# Altium project Fall22 Universal PCB Rev.1.PrjPcb (part 2 of 2)

## Sheet IO.SchDoc
size A2; SPICEModelCacheUFEYCXMP: <root> / <DocumentId>UFEYCXMP</DocumentId> / </root>
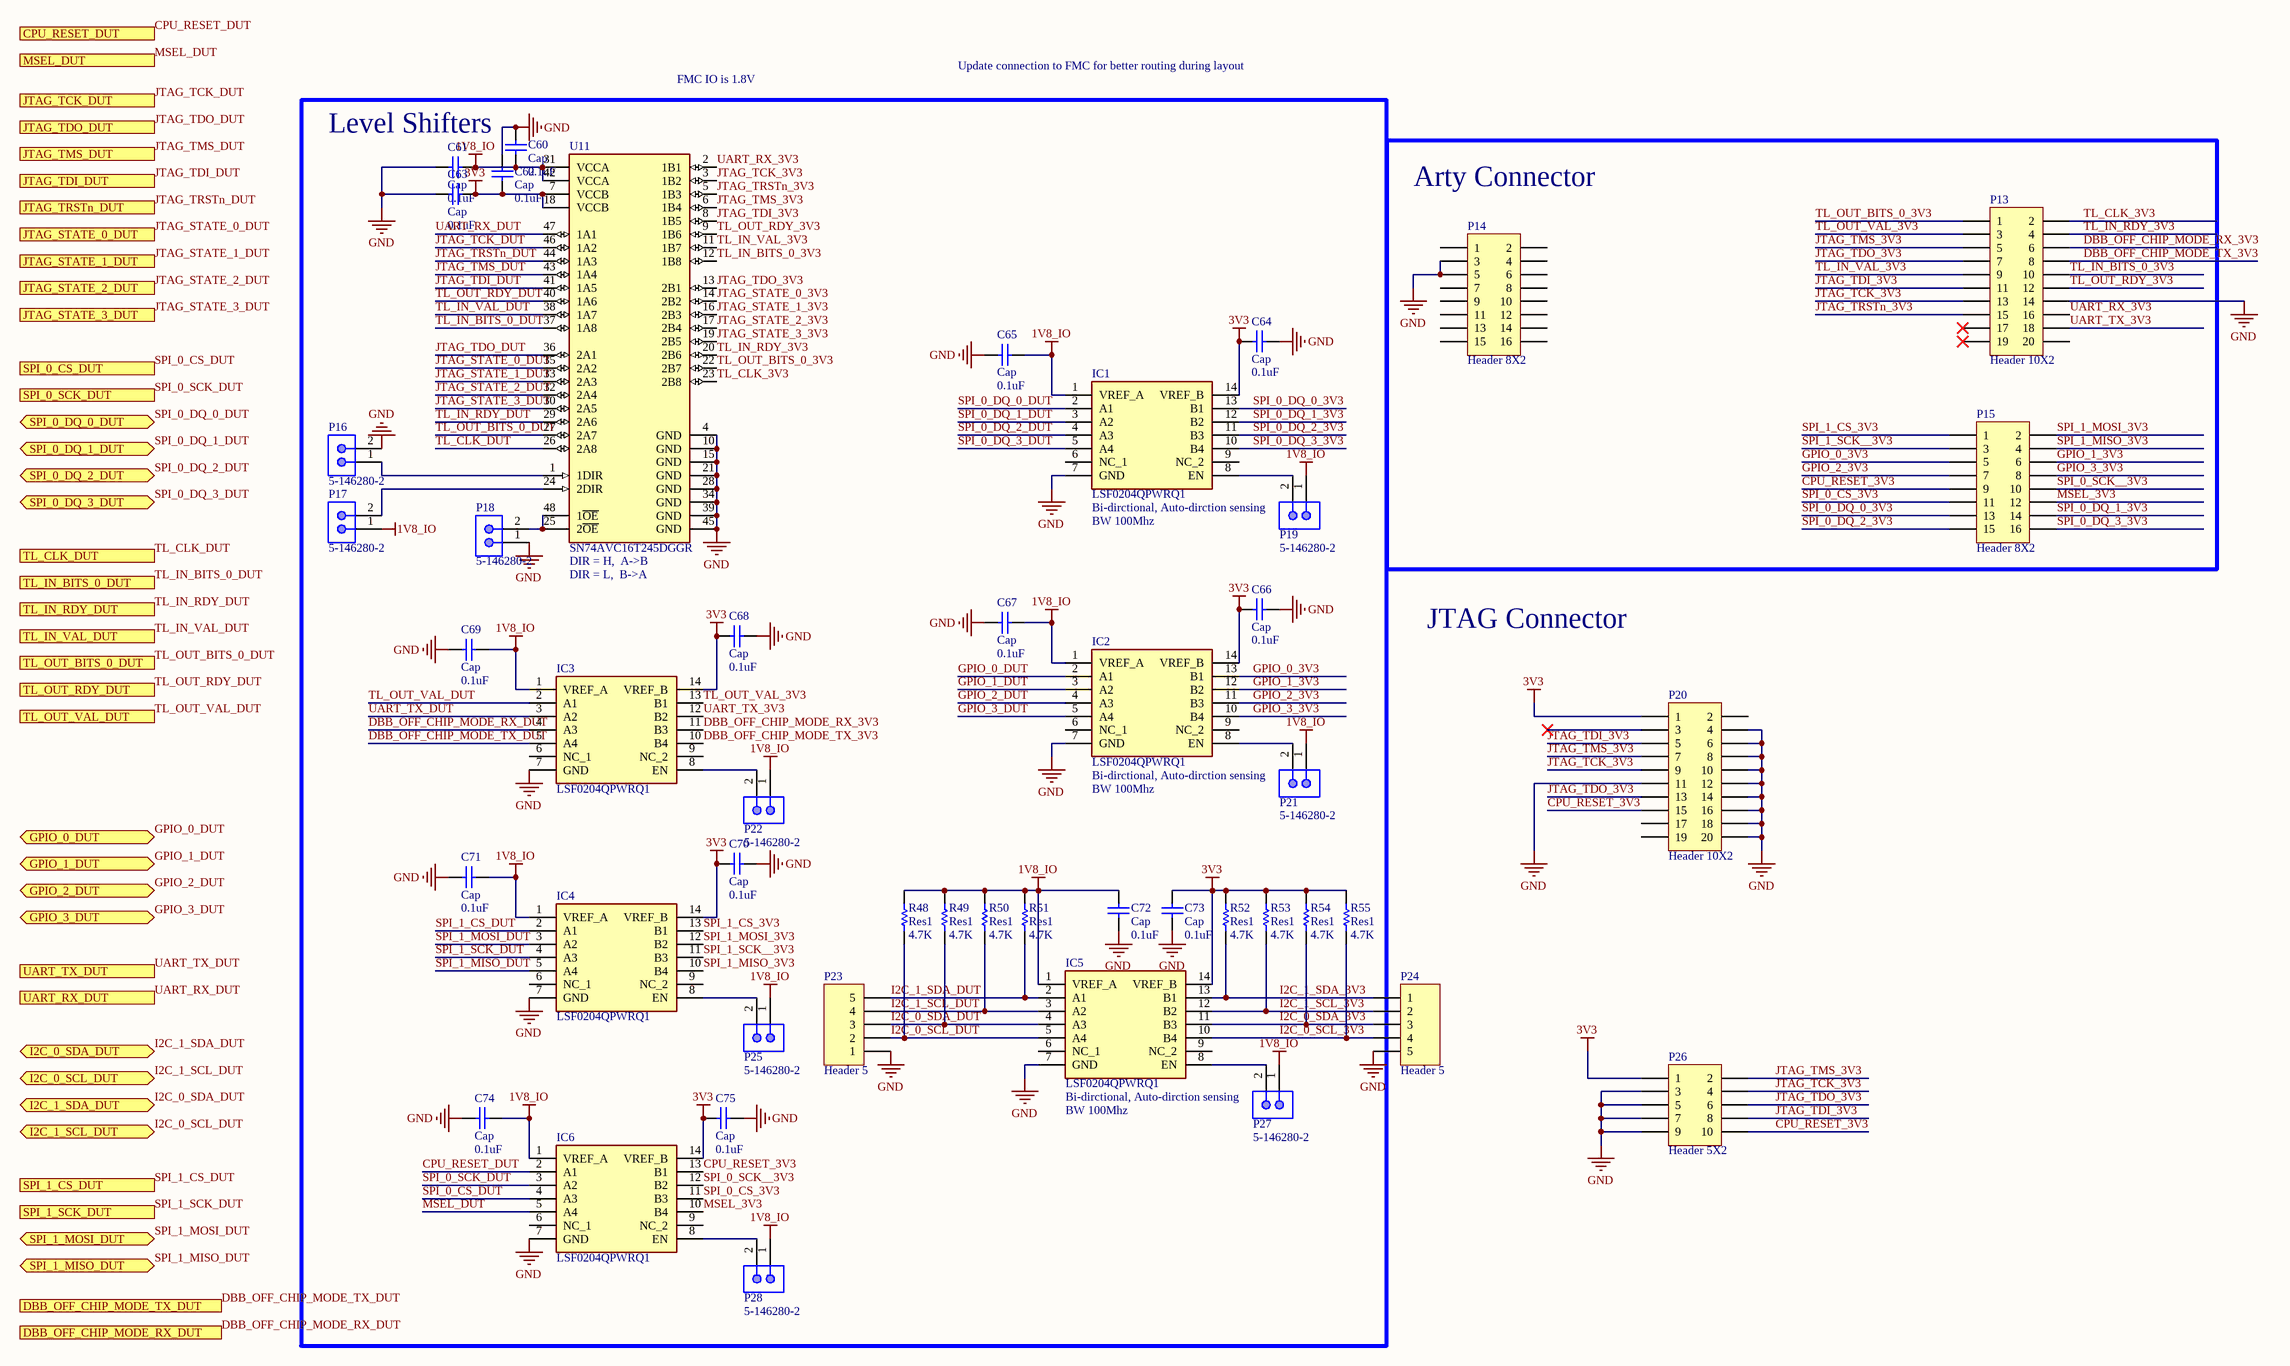
[diagram p7: IO.SchDoc]

### Parts
C60  Cap  value 0.1uF  [0603]
C61  Cap  value 0.1uF  [0603]
C62  Cap  value 0.1uF  [0603]
C63  Cap  value 0.1uF  [0603]
C64  Cap  value 0.1uF  [0603]
C65  Cap  value 0.1uF  [0603]
C66  Cap  value 0.1uF  [0603]
C67  Cap  value 0.1uF  [0603]
C68  Cap  value 0.1uF  [0603]
C69  Cap  value 0.1uF  [0603]
C70  Cap  value 0.1uF  [0603]
C71  Cap  value 0.1uF  [0603]
C72  Cap  value 0.1uF  [0603]
C73  Cap  value 0.1uF  [0603]
C74  Cap  value 0.1uF  [0603]
C75  Cap  value 0.1uF  [0603]
IC1  LSF0204QPWRQ1  [SOP65P640X120-14N]
IC2  LSF0204QPWRQ1  [SOP65P640X120-14N]
IC3  LSF0204QPWRQ1  [SOP65P640X120-14N]
IC4  LSF0204QPWRQ1  [SOP65P640X120-14N]
IC5  LSF0204QPWRQ1  [SOP65P640X120-14N]
IC6  LSF0204QPWRQ1  [SOP65P640X120-14N]
P13  Header 10X2  [HDR2X10]
P14  Header 8X2  [HDR2X8]
P15  Header 8X2  [HDR2X8]
P16  5-146280-2  [TECO-5-146280-2_V]
P17  5-146280-2  [TECO-5-146280-2_V]
P18  5-146280-2  [TECO-5-146280-2_V]
P19  5-146280-2  [TECO-5-146280-2_V]
P20  Header 10X2  [HDR2X10]
P21  5-146280-2  [TECO-5-146280-2_V]
P22  5-146280-2  [TECO-5-146280-2_V]
P23  Header 5  [HDR1X5]
P24  Header 5  [HDR1X5]
P25  5-146280-2  [TECO-5-146280-2_V]
P26  Header 5X2  [HDR2X5]
P27  5-146280-2  [TECO-5-146280-2_V]
P28  5-146280-2  [TECO-5-146280-2_V]
R48  Res1  value 4.7K  [0603]
R49  Res1  value 4.7K  [0603]
R50  Res1  value 4.7K  [0603]
R51  Res1  value 4.7K  [0603]
R52  Res1  value 4.7K  [0603]
R53  Res1  value 4.7K  [0603]
R54  Res1  value 4.7K  [0603]
R55  Res1  value 4.7K  [0603]
U11  SN74AVC16T245DGGR  [FP-DGG0048A-IPC_B]

### Blocks framed on the sheet
Level Shifters: C60-C75 IC1-IC6 P16-P19 P21-P23 P25 P27 P28 R48-R55 U11
Arty Connector: P13-P15

### Ports
CPU_RESET_DUT (out), DBB_OFF_CHIP_MODE_RX_DUT (in), DBB_OFF_CHIP_MODE_TX_DUT (in), GPIO_0_DUT (bidir), GPIO_1_DUT (bidir), GPIO_2_DUT (bidir), GPIO_3_DUT (bidir), I2C_0_SCL_DUT (bidir), I2C_0_SDA_DUT (bidir), I2C_1_SCL_DUT (bidir), I2C_1_SDA_DUT (bidir), JTAG_STATE_0_DUT (in), JTAG_STATE_1_DUT (in), JTAG_STATE_2_DUT (in), JTAG_STATE_3_DUT (in), JTAG_TCK_DUT (out), JTAG_TDI_DUT (out), JTAG_TDO_DUT (in), JTAG_TMS_DUT (out), JTAG_TRSTn_DUT (out), MSEL_DUT (out), SPI_0_CS_DUT (in), SPI_0_DQ_0_DUT (bidir), SPI_0_DQ_1_DUT (bidir), SPI_0_DQ_2_DUT (bidir), SPI_0_DQ_3_DUT (bidir), SPI_0_SCK_DUT (in), SPI_1_CS_DUT (in), SPI_1_MISO_DUT (bidir), SPI_1_MOSI_DUT (bidir), SPI_1_SCK_DUT (in), TL_CLK_DUT (in), TL_IN_BITS_0_DUT (out), TL_IN_RDY_DUT (in), TL_IN_VAL_DUT (out), TL_OUT_BITS_0_DUT (in), TL_OUT_RDY_DUT (out), TL_OUT_VAL_DUT (in), UART_RX_DUT (out), UART_TX_DUT (in)

### Nets
1V8_IO: C60.2 C61.1 C65.1 C67.1 C69.1 C71.1 C72.2 C74.1 IC1.1(VREF_A) IC2.1(VREF_A) IC3.1(VREF_A) IC4.1(VREF_A) IC5.1(VREF_A) IC6.1(VREF_A) P17.1 P19.1 P21.1 P22.1 P25.1 P27.1 P28.1 R48.2 R49.2 R50.2 R51.2 U11.31(VCCA) U11.42(VCCA)
3V3: C62.2 C63.1 C64.2 C66.2 C68.2 C70.2 C73.2 C75.2 IC1.14(VREF_B) IC2.14(VREF_B) IC3.14(VREF_B) IC4.14(VREF_B) IC5.14(VREF_B) IC6.14(VREF_B) P20.1 P26.1 R52.2 R53.2 R54.2 R55.2 U11.7(VCCB) U11.18(VCCB)
GND: C60.1 C61.2 C62.1 C63.2 C64.1 C65.2 C66.1 C67.2 C68.1 C69.2 C70.1 C71.2 C72.1 C73.1 C74.2 C75.1 IC1.7(GND) IC2.7(GND) IC3.7(GND) IC4.7(GND) IC5.7(GND) IC6.7(GND) P13.14 P14.3 P14.5 P16.2 P18.1 P20.4 P20.6 P20.8 P20.10 P20.11 P20.12 P20.14 P20.16 P20.18 P20.20 P23.1 P24.5 P26.3 P26.5 P26.7 P26.9 U11.4(GND) U11.10(GND) U11.15(GND) U11.21(GND) U11.28(GND) U11.34(GND) U11.39(GND) U11.45(GND)
CPU_RESET_3V3: IC6.13(B1) P15.9 P20.15 P26.10
CPU_RESET_DUT: IC6.2(A1) ; port CPU_RESET_DUT
DBB_OFF_CHIP_MODE_RX_3V3: IC3.11(B3) P13.6
DBB_OFF_CHIP_MODE_RX_DUT: IC3.4(A3) ; port DBB_OFF_CHIP_MODE_RX_DUT  [project net baseband_offChipMode_rx]
DBB_OFF_CHIP_MODE_TX_3V3: IC3.10(B4) P13.8
DBB_OFF_CHIP_MODE_TX_DUT: IC3.5(A4) ; port DBB_OFF_CHIP_MODE_TX_DUT  [project net baseband_offChipMode_tx]
GPIO_0_3V3: IC2.13(B1) P15.5
GPIO_0_DUT: IC2.2(A1) ; port GPIO_0_DUT
GPIO_1_3V3: IC2.12(B2) P15.6
GPIO_1_DUT: IC2.3(A2) ; port GPIO_1_DUT
GPIO_2_3V3: IC2.11(B3) P15.7
GPIO_2_DUT: IC2.4(A3) ; port GPIO_2_DUT
GPIO_3_3V3: IC2.10(B4) P15.8
GPIO_3_DUT: IC2.5(A4) ; port GPIO_3_DUT
I2C_0_SCL_3V3: IC5.10(B4) P24.4 R55.1
I2C_0_SCL_DUT: IC5.5(A4) P23.2 R48.1 ; port I2C_1_SCL_DUT
I2C_0_SDA_3V3: IC5.11(B3) P24.3 R54.1
I2C_0_SDA_DUT: IC5.4(A3) P23.3 R49.1 ; port I2C_1_SDA_DUT
I2C_1_SCL_3V3: IC5.12(B2) P24.2 R53.1
I2C_1_SCL_DUT: IC5.3(A2) P23.4 R50.1 ; port I2C_0_SCL_DUT
I2C_1_SDA_3V3: IC5.13(B1) P24.1 R52.1
I2C_1_SDA_DUT: IC5.2(A1) P23.5 R51.1 ; port I2C_0_SDA_DUT
JTAG_STATE_0_3V3: U11.14(2B2)
JTAG_STATE_0_DUT: U11.35(2A2) ; port JTAG_STATE_0_DUT
JTAG_STATE_1_3V3: U11.16(2B3)
JTAG_STATE_1_DUT: U11.33(2A3) ; port JTAG_STATE_1_DUT
JTAG_STATE_2_3V3: U11.17(2B4)
JTAG_STATE_2_DUT: U11.32(2A4) ; port JTAG_STATE_2_DUT
JTAG_STATE_3_3V3: U11.19(2B5)
JTAG_STATE_3_DUT: U11.30(2A5) ; port JTAG_STATE_3_DUT
JTAG_TCK_3V3: P13.13 P20.9 P26.4 U11.3(1B2)
JTAG_TCK_DUT: U11.46(1A2) ; port JTAG_TCK_DUT  [project net JTAG_TCK]
JTAG_TDI_3V3: P13.11 P20.5 P26.8 U11.8(1B5)
JTAG_TDI_DUT: U11.41(1A5) ; port JTAG_TDI_DUT  [project net JTAG_TDI]
JTAG_TDO_3V3: P13.7 P20.13 P26.6 U11.13(2B1)
JTAG_TDO_DUT: U11.36(2A1) ; port JTAG_TDO_DUT  [project net JTAG_TDO]
JTAG_TMS_3V3: P13.5 P20.7 P26.2 U11.6(1B4)
JTAG_TMS_DUT: U11.43(1A4) ; port JTAG_TMS_DUT  [project net JTAG_TMS]
JTAG_TRSTn_3V3: P13.15 U11.5(1B3)
JTAG_TRSTn_DUT: U11.44(1A3) ; port JTAG_TRSTn_DUT  [project net JTAG_TRST]
MSEL_3V3: IC6.10(B4) P15.12
MSEL_DUT: IC6.5(A4) ; port MSEL_DUT  [project net BOOT_SEL]
SPI_0_CS_3V3: IC6.11(B3) P15.11
SPI_0_CS_DUT: IC6.4(A3) ; port SPI_0_CS_DUT  [project net SPI0_CS]
SPI_0_DQ_0_3V3: IC1.13(B1) P15.13
SPI_0_DQ_0_DUT: IC1.2(A1) ; port SPI_0_DQ_0_DUT  [project net SPI0_DQ0]
SPI_0_DQ_1_3V3: IC1.12(B2) P15.14
SPI_0_DQ_1_DUT: IC1.3(A2) ; port SPI_0_DQ_1_DUT  [project net SPI0_DQ1]
SPI_0_DQ_2_3V3: IC1.11(B3) P15.15
SPI_0_DQ_2_DUT: IC1.4(A3) ; port SPI_0_DQ_2_DUT  [project net SPI0_DQ2]
SPI_0_DQ_3_3V3: IC1.10(B4) P15.16
SPI_0_DQ_3_DUT: IC1.5(A4) ; port SPI_0_DQ_3_DUT  [project net SPI0_DQ3]
SPI_0_SCK__3V3: IC6.12(B2) P15.10
SPI_0_SCK_DUT: IC6.3(A2) ; port SPI_0_SCK_DUT  [project net SPI0_SCLK]
SPI_1_CS_3V3: IC4.13(B1) P15.1
SPI_1_CS_DUT: IC4.2(A1) ; port SPI_1_CS_DUT  [project net SCAN_SEL]
SPI_1_MISO_3V3: IC4.10(B4) P15.4
SPI_1_MISO_DUT: IC4.5(A4) ; port SPI_1_MISO_DUT  [project net SCAN_IN]
SPI_1_MOSI_3V3: IC4.12(B2) P15.2
SPI_1_MOSI_DUT: IC4.3(A2) ; port SPI_1_MOSI_DUT  [project net SCAN_OUT]
SPI_1_SCK__3V3: IC4.11(B3) P15.3
SPI_1_SCK_DUT: IC4.4(A3) ; port SPI_1_SCK_DUT  [project net SCAN_CLK]
TL_CLK_3V3: P13.2 U11.23(2B8)
TL_CLK_DUT: U11.26(2A8) ; port TL_CLK_DUT  [project net TL_CLK]
TL_IN_BITS_0_3V3: P13.10 U11.12(1B8)
TL_IN_BITS_0_DUT: U11.37(1A8) ; port TL_IN_BITS_0_DUT
TL_IN_RDY_3V3: P13.4 U11.20(2B6)
TL_IN_RDY_DUT: U11.29(2A6) ; port TL_IN_RDY_DUT  [project net TL_IN_RDY]
TL_IN_VAL_3V3: P13.9 U11.11(1B7)
TL_IN_VAL_DUT: U11.38(1A7) ; port TL_IN_VAL_DUT  [project net TL_IN_VAL]
TL_OUT_BITS_0_3V3: P13.1 U11.22(2B7)
TL_OUT_BITS_0_DUT: U11.27(2A7) ; port TL_OUT_BITS_0_DUT
TL_OUT_RDY_3V3: P13.12 U11.9(1B6)
TL_OUT_RDY_DUT: U11.40(1A6) ; port TL_OUT_RDY_DUT  [project net TL_OUT_RDY]
TL_OUT_VAL_3V3: IC3.13(B1) P13.3
TL_OUT_VAL_DUT: IC3.2(A1) ; port TL_OUT_VAL_DUT  [project net TL_OUT_VAL]
UART_RX_3V3: P13.16 U11.2(1B1)
UART_RX_DUT: U11.47(1A1) ; port UART_RX_DUT  [project net UART0_RX]
UART_TX_3V3: IC3.12(B2) P13.18
UART_TX_DUT: IC3.3(A2) ; port UART_TX_DUT  [project net UART0_TX]
NetIC1_8: IC1.8(EN) P19.2
NetIC2_8: IC2.8(EN) P21.2
NetIC3_8: IC3.8(EN) P22.2
NetIC4_8: IC4.8(EN) P25.2
NetIC5_8: IC5.8(EN) P27.2
NetIC6_8: IC6.8(EN) P28.2
NetP16_1: P16.1 U11.1(1DIR)
NetP17_2: P17.2 U11.24(2DIR)
NetP18_2: P18.2 U11.25(2~{OE}) U11.48(1~{OE})

Not connected (* = marked no-connect by the designer): IC1 6(NC_1) 9(NC_2); IC2 6(NC_1) 9(NC_2); IC3 6(NC_1) 9(NC_2); IC4 6(NC_1) 9(NC_2); IC5 6(NC_1) 9(NC_2); IC6 6(NC_1) 9(NC_2); P13 17* 19* 20; P14 1 2 4 6 7 8 9 10 11 12 13 14 15 16; P20 2 3* 17 19

### Notes on the sheet
- FMC IO is 1.8V
- Update connection to FMC for better routing during layout
- (near U11) DIR = H,  A->B
- (near P19) Bi-dirctional, Auto-dirction sensing
- (near IC1) BW 100Mhz
- (near U11) DIR = L,  B->A
- JTAG Connector
- (near P21) Bi-dirctional, Auto-dirction sensing
- (near IC2) BW 100Mhz
- (near P27) Bi-dirctional, Auto-dirction sensing
- (near IC5) BW 100Mhz

### Library data of the parts
C60-C75 = Cap: Capacitor; Published: 8-Jun-2000; LatestRevisionDate: 17-Jul-2002; LatestRevisionNote: Re-released for DXP Platform.; PackageReference: RAD-0.3; Publisher: Altium Limited; PackageDescription: Radial Cap, Thru-Hole; 2 Leads; 0.3 in Pin Spacing
IC1-IC6 = CMP-016-000005-1: Automotive 4-Bit Bidirectional Multi-Voltage Level Translator for Open-Drain or Push- Pull Interface; Manufacturer_Name: Texas Instruments; Manufacturer_Part_Number: LSF0204QPWRQ1; Mouser Part Number: 595-LSF0204QPWRQ1; Arrow Part Number: LSF0204QPWRQ1; Design Item ID: LSF0204QPWRQ1; Datasheet Link: http://www.ti.com/lit/gpn/lsf0204-q1; Height: 1.2mm; Mouser Price/Stock: https://www.mouser.co.uk/ProductDetail/Texas-Instruments/LSF0204QPWRQ1?qs=w%2Fv1CP2dgqqt88p%2F1xId1A%3D%3D; Source: SamacSys.SchLib; Arrow Price/Stock: https://www.arrow.com/en/products/lsf0204qpwrq1/texas-instruments?region=nac
P13 P20 = Header 10X2: Header, 10-Pin, Dual row; LatestRevisionDate: 17-Jul-2002; LatestRevisionNote: Re-released for DXP Platform.; Publisher: Altium Limited
P14 P15 = Header 8X2: Header, 8-Pin, Dual row; LatestRevisionDate: 17-Jul-2002; LatestRevisionNote: Re-released for DXP Platform.; Publisher: Altium Limited
P16-P19 P21 P22 P25 P27 P28 = CMP-2000-07492-1: Male Header, Pitch 2.54 mm, 1 x 2 Position, Height 8.21 mm, Tail Length 3.05 mm, -65 to 105 degC, RoHS, Bulk; Manufacturer: TE Connectivity; Mating Connector Lock: No(Without); Number of Positions: 2; Pitch: 2.54mm; PCB Mounting Orientation: Vertical; Keyed: No; Case\/Package: 100; Mating Post Length: 0.23inch; High Temperature Housing: Yes; Max Current Rating: 5A; PCB Thickness: 0.063inch; PCB Mount Retention: Without; Approvals: CSA; Current Rating: 3A; Radiation Hardening: No; Length: 4.67mm; Contact Mating Length: 0.23inch; Connector Type: Header; Number of Rows: 1; Termination Post Length: 0.12inch; Board Standoff: No(Without); Max Operating Temperature: 105degC; Contact Shape: Square; Selectively Loaded: No(Without); Gasket: No(Without); Number of Contacts: 2; Contact Gender: Male; Mating Alignment: No(Without); Manufacturer URL: http://www.te.com/; Datasheet URL: http://www.te.com/commerce/DocumentDelivery/DDEController?Action=showdoc&DocId=Customer+Drawing%7F146280%7FH1%7Fpdf%7FEnglish%7FENG_CD_146280_H1.pdf%7F5-146280-2; Mount: ThroughHole; Orientation: Straight; Packaging: Carton; Package Reference: 5-146280-2; Package Quantity: 500; Stabilizers: No(Without); Row Spacing: 2.54mm; Contact Material: CopperAlloy; Panel Mount Retention: No(Without); Datasheet Version: Rev. H1, 08/2016; Housing Colour: Black; Colour: Black; Package Description: Male Header, Pitch 2.54 mm, 1 x 2 Position, Height 8.21 mm, Tail Length 3.05 mm; Contact Plating: Matte; Housing Material: Polymer; Contact Protection: No(Without); Min Operating Temperature: -65degC; Mounting Technology: ThroughHole; Flammability Rating: UL94V-0; RoHSCompliant: true; Termination: ThroughHole; Depth: 2.34mm; High Speed Serial Data Connector: No
P23 P24 = Header 5: Header, 5-Pin; LatestRevisionDate: 17-Jul-2002; LatestRevisionNote: Re-released for DXP Platform.; Publisher: Altium Limited
P26 = Header 5X2: Header, 5-Pin, Dual row; LatestRevisionDate: 17-Jul-2002; LatestRevisionNote: Re-released for DXP Platform.; Publisher: Altium Limited
R48-R55 = Res1: Resistor; Published: 8-Jun-2000; LatestRevisionDate: 17-Jul-2002; LatestRevisionNote: Re-released for DXP Platform.; PackageReference: AXIAL-0.3; Publisher: Altium Limited; PackageDescription: Axial Device, Thru-Hole; 2 Leads; 0.3 in Pin Spacing
U11 = CMP-04899-000056-1: IC TRNSLTR BIDIRECTIONAL 48TSSOP; Max Supply Voltage: 3.6V; Min Supply Voltage: 1.2V; Number of Channels: 2; Turn-On Delay Time: 5ns; Data Rate: 380Mbps; Logic Function: Translator; High Level Output Current: -12mA; Propagation Delay: 2.7ns; Polarity: Non-Inverting; Low Level Output Current: 12mA; Number of Bits: 16; Package Quantity: 1; Case/Package: TSSOP; Contact Plating: Gold; Length: 12.6mm; Number of Elements: 2; Mount: Surface Mount; Weight: 0.007873oz; Lead Free: Lead Free; Width: 6.2mm; Number of Pins: 48; Direction: Bidirectional; Min Operating Temperature: -40°C; REACH SVHC: No SVHC; Packaging: Tape and Reel; Max Operating Temperature: 85°C; Height: 1.05mm; RoHS Compliant: Yes; Radiation Hardening: No

## Sheet RF.SchDoc
size 594 x 420 mm
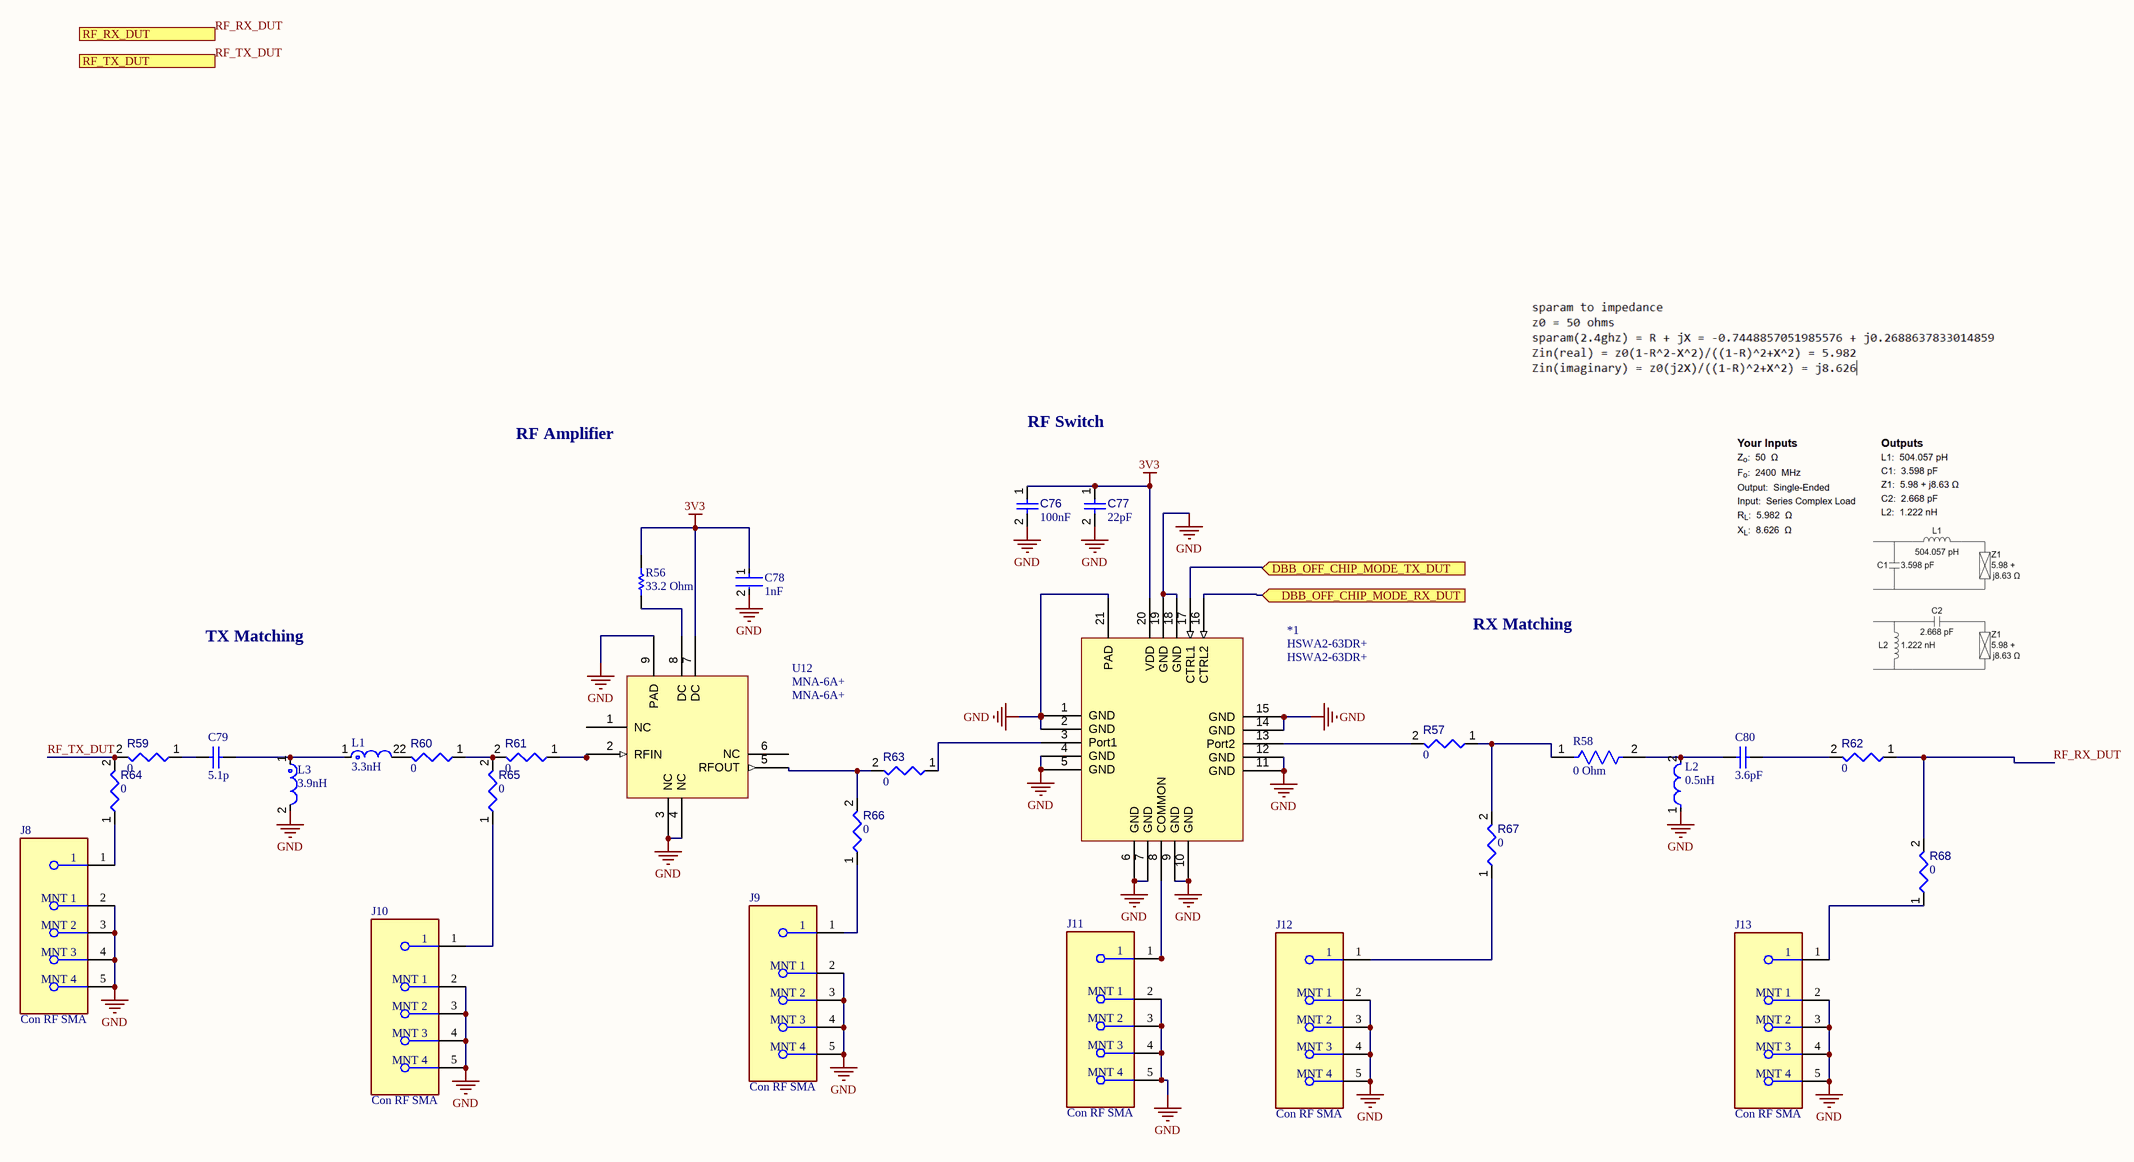
[diagram p8: RF.SchDoc]

### Parts
*1  HSWA2-63DR+  [HSWA2-63DR+-Footprint-1]
C76  value 100nF  [CAPC1005X56X25LL10T15]  (hidden comment: 0.1uF)
C77  22pF  [CAPC0402(1005)60_L]
C78  1nF  [FP-CL10-IPC_C]
C79  5.1p  [CAPC1608X90X35NL15T15]
C80  3.6pF  [CAPC1608X74X38LL10T13]
J8  Con RF SMA  [FP-RF2-04A-T-00-50-G-MFG]
J9  Con RF SMA  [FP-RF2-04A-T-00-50-G-MFG]
J10  Con RF SMA  [FP-RF2-04A-T-00-50-G-MFG]
J11  Con RF SMA  [FP-RF2-04A-T-00-50-G-MFG]
J12  Con RF SMA  [FP-RF2-04A-T-00-50-G-MFG]
J13  Con RF SMA  [FP-RF2-04A-T-00-50-G-MFG]
L1  3.3nH  [FP-LQG18HH_00-MFG]
L2  0.5nH  [FP-LQW18AN_00-MFG]
L3  3.9nH  [FP-LQG18HH_00-MFG]
R56  33.2 Ohm  [RESC1608X55X25NL10T15]
R57  value 0  [RESC0603(1608)_L]  (hidden comment: 0R3J)
R58  0 Ohm  [FP-CRCW0603-C-IPC_B]
R59  value 0  [RESC0603(1608)_L]  (hidden comment: 0R3J)
R60  value 0  [RESC0603(1608)_L]  (hidden comment: 0R3J)
R61  value 0  [RESC0603(1608)_L]  (hidden comment: 0R3J)
R62  value 0  [RESC0603(1608)_L]  (hidden comment: 0R3J)
R63  value 0  [RESC0603(1608)_L]  (hidden comment: 0R3J)
R64  value 0  [RESC0603(1608)_L]  (hidden comment: 0R3J)
R65  value 0  [RESC0603(1608)_L]  (hidden comment: 0R3J)
R66  value 0  [RESC0603(1608)_L]  (hidden comment: 0R3J)
R67  value 0  [RESC0603(1608)_L]  (hidden comment: 0R3J)
R68  value 0  [RESC0603(1608)_L]  (hidden comment: 0R3J)
U12  MNA-6A+  [MNA-6A+-Footprint-1]

### Ports
DBB_OFF_CHIP_MODE_RX_DUT (in), DBB_OFF_CHIP_MODE_TX_DUT (in), RF_RX_DUT (out), RF_TX_DUT (in)

### Nets
3V3: *1.20(VDD) C76.1 C77.1 C78.1 R56.2 U12.7(DC)
GND: *1.1(GND) *1.2(GND) *1.4(GND) *1.5(GND) *1.6(GND) *1.7(GND) *1.9(GND) *1.10(GND) *1.11(GND) *1.12(GND) *1.14(GND) *1.15(GND) *1.18(GND) *1.19(GND) *1.21(PAD) C76.2 C77.2 C78.2 J8.2(MNT_1) J8.3(MNT_2) J8.4(MNT_3) J8.5(MNT_4) J9.2(MNT_1) J9.3(MNT_2) J9.4(MNT_3) J9.5(MNT_4) J10.2(MNT_1) J10.3(MNT_2) J10.4(MNT_3) J10.5(MNT_4) J11.2(MNT_1) J11.3(MNT_2) J11.4(MNT_3) J11.5(MNT_4) J12.2(MNT_1) J12.3(MNT_2) J12.4(MNT_3) J12.5(MNT_4) J13.2(MNT_1) J13.3(MNT_2) J13.4(MNT_3) J13.5(MNT_4) L2.1 L3.2 U12.3(NC) U12.4(NC) U12.9(PAD)
baseband_offChipMode_rx: *1.16(CTRL2) ; port DBB_OFF_CHIP_MODE_RX_DUT
baseband_offChipMode_tx: *1.17(CTRL1) ; port DBB_OFF_CHIP_MODE_TX_DUT
RF_RX_DUT: R62.1 R68.2 ; port RF_RX_DUT
RF_TX_DUT: R59.2 R64.2 ; port RF_TX_DUT
Net*1_3: *1.3(Port1) R63.1
Net*1_8: *1.8(COMMON) J11.1
Net*1_13: *1.13(Port2) R57.2
NetC79_1: C79.1 R59.1
NetC79_2: C79.2 L1.1 L3.1
NetC80_1: C80.1 L2.2 R58.2
NetC80_2: C80.2 R62.2
NetJ8_1: J8.1 R64.1
NetJ9_1: J9.1 R66.1
NetJ10_1: J10.1 R65.1
NetJ12_1: J12.1 R67.1
NetJ13_1: J13.1 R68.1
NetL1_2: L1.2 R60.2
NetR56_1: R56.1 U12.8(DC)
NetR57_1: R57.1 R58.1 R67.2
NetR60_1: R60.1 R61.2 R65.2
NetR61_1: R61.1 U12.2(RFIN)
NetR63_2: R63.2 R66.2 U12.5(RFOUT)

Not connected (* = marked no-connect by the designer): U12 1(NC) 6(NC)

### Notes on the sheet
- RF Amplifier
- RF Switch
- TX Matching
- RX Matching

### Library data of the parts
*1 = CMP-005-000000-2: Absorptive SPDT, SMT Solid State; Manufacturer: Mini-Circuits; U10: HSWA2-63DR+; RoHS Compliant: Yes; Manufacturer Part Number: HSWA2-63DR+; RoHS: Yes; Source: Schlib1.SchLib; Stock 1: 1789; Pricing 1: 1=5.16000, 10=4.61000, 50=4.15000, 100=3.72000, 1000=2.18000, 10000=2.18000 (USD); Design Item ID: HSWA2-63DR+
C76 = CMP-001-00001-6: Chip Capacitor, 0.1 uF, +/- 5%, 16 V, 0402 (1005 Metric); Capacitor Type: Ceramic; Voltage Rating: 16V; Max Operating Temperature: 125°C; Min Operating Temperature: -55°C; Case/Package: 0402; Mounting Technology: SM; Pins: 2; Tolerance: 5%; RoHS Compliant: True
C77 = CMP-001-00073-3: Chip Capacitor, 22pF +/-10%, 50V, 0402, Thickness 0.6 mm; Tolerance: 10%; Pins: 2; Voltage Rating: 50V; Max Operating Temperature: 85°C; Min Operating Temperature: -55°C; Mounting Technology: SMT; Case/Package: 0402; Value: 22pF
C78 = CMP-2000-06091-2: Cap Ceramic 1nF 50V X7R ±10% Pad SMD 0603 +125°C T/R; Radiation Hardening: No; Length: 1.6mm; Capacitance: 1nF; Voltage Rating: 50V; Case Code (Imperial): 0603; Case Code (Metric): 1608; Max Operating Temperature: 125°C; Thickness: 0.035inch; Voltage Rating (DC): 50V; Contact Plating: Tin; Width: 0.031inch; Mount: Surface Mount; Lead Free: Lead Free; Voltage: 50V; Material: Ceramic; Package Quantity: 1; Dielectric: X7R; Case/Package: 0603; Height: 0.8mm; Min Operating Temperature: -55°C; Tolerance: 10%; Depth: 0.8mm; Packaging: Tape and Reel
C79 = CMP-2006-04578-1: Part Number: 06031A5R1CAT2A; Manufacturer: AVX Interconnect / Elco
C80 = CMP-2006-03975-1: Manufacturer: AVX Interconnect / Elco; Part Number: ML03V13R6BAT2A
J8-J13 = CMP-42753-000002-1: CONN SMA JACK STR 50 OHM PCB
L1 = CMP-06042-009861-1: Multilayer type RF Inductor 3.3nH ±0.3nH 0.12Ω 1000mA 0603; Max DC Current: 500mA; Q Factor: 12; DC Resistance (DCR): 150mR; Test Frequency: 100MHz; Self Resonant Frequency: 6GHz; Shielding: Unshielded; Core Material: Air; Case/Package: 0603; DC Current: 500mA; Case Code (Metric): 1608; Package Quantity: 4000; Depth: 0.95mm; Max Operating Temperature: 85°C; Height - Seated (Max): 0.037inch; Mount: Surface Mount; REACH SVHC: No SVHC; Length: 1.6mm; Min Operating Temperature: -55°C; Military Standard: Not; Lead Free: Lead Free; Width: 0.8mm; Packaging: Tape and Reel; Height: 0.8mm; Termination: SMD/SMT; Current Rating: 500mA; Case Code (Imperial): 0603; Inductance: 3.3nH; Radiation Hardening: No
L2 = CMP-06042-003914-1: Wire Wound RF Inductor 5.6nH ±0.5nH 750mA 0.082Ω 0603 (1608); Test Frequency: 100MHz; Self Resonant Frequency: 6GHz; Q Factor: 35; Core Material: Non-Magnetic; DC Resistance (DCR): 82mR; Shielding: Unshielded; Number of Pins: 2; Case Code (Imperial): 0603; Height: 0.8mm; Packaging: Tape and Reel; Case/Package: 0603; Lead Free: Lead Free; Height - Seated (Max): 0.039inch; Width: 0.8mm; Military Standard: Not; Weight: 0.000106oz; Length: 1.6mm; Case Code (Metric): 1608; Radiation Hardening: No; DC Current: 750mA; Resistor Type: Wirewound; Min Operating Temperature: -55°C; Max DC Current: 750mA; Package Quantity: 4000; Current Rating: 750mA; Termination: SMD/SMT; Depth: 1mm; Max Operating Temperature: 125°C; REACH SVHC: No SVHC; Mount: Surface Mount; Inductance: 5.6nH
L3 = CMP-06042-010111-1: Multilayer type RF Inductor 3.9nH ±0.3nH 0.15Ω 900mA 0603; Core Material: Air; Max DC Current: 450mA; Q Factor: 12; DC Resistance (DCR): 150mR; Shielding: Unshielded; Self Resonant Frequency: 6GHz; Test Frequency: 100MHz; Packaging: Tape and Reel; Radiation Hardening: No; Package Quantity: 4000; Height - Seated (Max): 0.037inch; Case Code (Metric): 1608; Military Standard: Not; Depth: 0.95mm; DC Current: 450mA; Height: 0.8mm; Length: 1.6mm; Lead Free: Lead Free; Min Operating Temperature: -55°C; Mount: Surface Mount; REACH SVHC: No SVHC; Case Code (Imperial): 0603; Max Operating Temperature: 85°C; Case/Package: 0603; Width: 0.8mm; Termination: SMD/SMT; Inductance: 3.9nH; Current Rating: 450mA
R56 = CMP-2000-04014-1: Manufacturer: Yageo; Part Number: RC0603FR-0733R2L
R57 R59-R68 = CMP-009-00063-2: Jumper 0603 (1608 Metric); Case/Package: 0603; Mounting Technology: SMT; Pins: 2
R58 = CMP-02407-012292-2: RES 0 OHM JUMPER 1/10W 0603; Resistance: 22R; Power Rating: 100mW; Case/Package: Molded; Contact Plating: Tin; Resistor Type: Thick Film; Min Operating Temperature: -55°C; Termination: Wraparound; Max Operating Temperature: 155°C; Lead Free: Lead Free; Length: 1.55mm; RoHS Compliant: Yes; Mount: Surface Mount
U12 = CMP-003-000000-2: RF Amp Single MMIC Amp 2.5GHz 5V 8-Pin Case DQ-849 T/R; Manufacturer: Mini-Circuits; U11: MNA-6A+; Pricing 1: 1=5.10000, 10=4.55800, 50=4.10220, 100=3.73760, 500=3.02652, 1000=2.55248 (USD); RoHS: Yes; Stock 1: 29769; Category: RF Amplifiers; Source: Schlib1.SchLib; Design Item ID: MNA-6A+; RoHS Compliant: Yes; Manufacturer Part Number: MNA-6A+

## Nets that join several sheets
1V8_DUT: DUT (6 pins), Power (5 pins)
1V8_IO: Power (P12.2 R15.1), IO (27 pins)
3V3: Power (24 pins), IO (22 pins), RF (6 pins)
FMC_3V3: DUT (5 pins), Power (P2.2)
GND: DUT (304 pins), Power (91 pins), IO (51 pins), RF (47 pins)
LDO_VDD_A_RF: DUT (U13.137 U13.138), Power (P11.2 R25.1)
LDO_VDD_ALWAYS_ON: DUT (U13.49), Power (P9.2 R13.1)
LDO_VDD_D: DUT (U13.135 U13.136 U13.190), Power (P7.2 R22.1)
VDD_A_RF: DUT (U13.12 U13.155), Power (6 pins)
VDD_ALWAYS_ON: DUT (U13.189), Power (6 pins)
VDD_BATT: DUT (30 pins), Power (5 pins)
VDD_D: DUT (U13.152), Power (6 pins)
baseband_offChipMode_rx: DUT (J14.E33 P30.1 U13.8), IO (IC3.4), RF (*1.16)
baseband_offChipMode_tx: DUT (J14.E34 P30.3 U13.27), IO (IC3.5), RF (*1.17)
BOOT_SEL: DUT (J14.H20 P29.7 P33.2 U13.280), IO (IC6.5)
CPU_RESET_DUT: DUT (6 pins), IO (IC6.2)
GPIO_0_DUT: DUT (J14.E30 P30.2 U13.44), IO (IC2.2)
GPIO_1_DUT: DUT (J14.F4 P29.6 U13.317), IO (IC2.3)
GPIO_2_DUT: DUT (J14.E7 P29.3 U13.318), IO (IC2.4)
I2C2_SCL: DUT (J14.C30), Power (P3.1 U2.9 U4.9 U6.9)
I2C2_SDA: DUT (J14.C31), Power (7 pins)
JTAG_TCK: DUT (J14.G16 P29.27 R70.2 U13.42), IO (U11.46)
JTAG_TDI: DUT (J14.G18 P29.23 R71.2 U13.5), IO (U11.41)
JTAG_TDO: DUT (J14.G19 P29.24 R72.2 U13.41), IO (U11.36)
JTAG_TMS: DUT (J14.G15 P29.25 R73.2 U13.6), IO (U11.43)
JTAG_TRST: DUT (J14.G21 P29.26 R74.2 U13.24), IO (U11.44)
RF_RX_DUT: DUT (U13.180), RF (R62.1 R68.2)
RF_TX_DUT: DUT (U13.144), RF (R59.2 R64.2)
SCAN_CLK: DUT (J14.E10 P29.5 U13.281), IO (IC4.4)
SCAN_IN: DUT (J14.E13 P29.9 U13.298), IO (IC4.5)
SCAN_OUT: DUT (J14.E9 P29.4 U13.300), IO (IC4.3)
SCAN_SEL: DUT (J14.E6 P29.2 U13.282), IO (IC4.2)
SPI0_CS: DUT (J14.H7 P29.10 U13.279), IO (IC6.4)
SPI0_DQ0: DUT (J14.H10 P29.11 U13.315), IO (IC1.2)
SPI0_DQ1: DUT (J14.H11 P29.13 U13.278), IO (IC1.3)
SPI0_DQ2: DUT (J14.H13 P29.12 U13.297), IO (IC1.4)
SPI0_DQ3: DUT (J14.H14 P29.14 U13.314), IO (IC1.5)
SPI0_SCLK: DUT (J14.H8 P29.15 U13.313), IO (IC6.3)
TL_CLK: DUT (J14.G2 P29.16 R81.2), IO (U11.26)
TL_IN_BITS_0_DUT: DUT (J14.G6 P29.17 R78.2), IO (U11.37)
TL_IN_RDY: DUT (J14.G12 P29.19 R79.2), IO (U11.29)
TL_IN_VAL: DUT (J14.G9 P29.20 R77.2), IO (U11.38)
TL_OUT_BITS_0_DUT: DUT (J14.G7 P29.18 R76.2), IO (U11.27)
TL_OUT_RDY: DUT (J14.G13 P29.22 R84.2), IO (U11.40)
TL_OUT_VAL: DUT (J14.G10 P29.21 R83.2), IO (IC3.2)
UART0_RX: DUT (J14.H17 P29.29 U13.43), IO (U11.47)
UART0_TX: DUT (J14.H16 P29.28 U13.25), IO (IC3.3)